# Altium project PCB_Project.PrjPcb
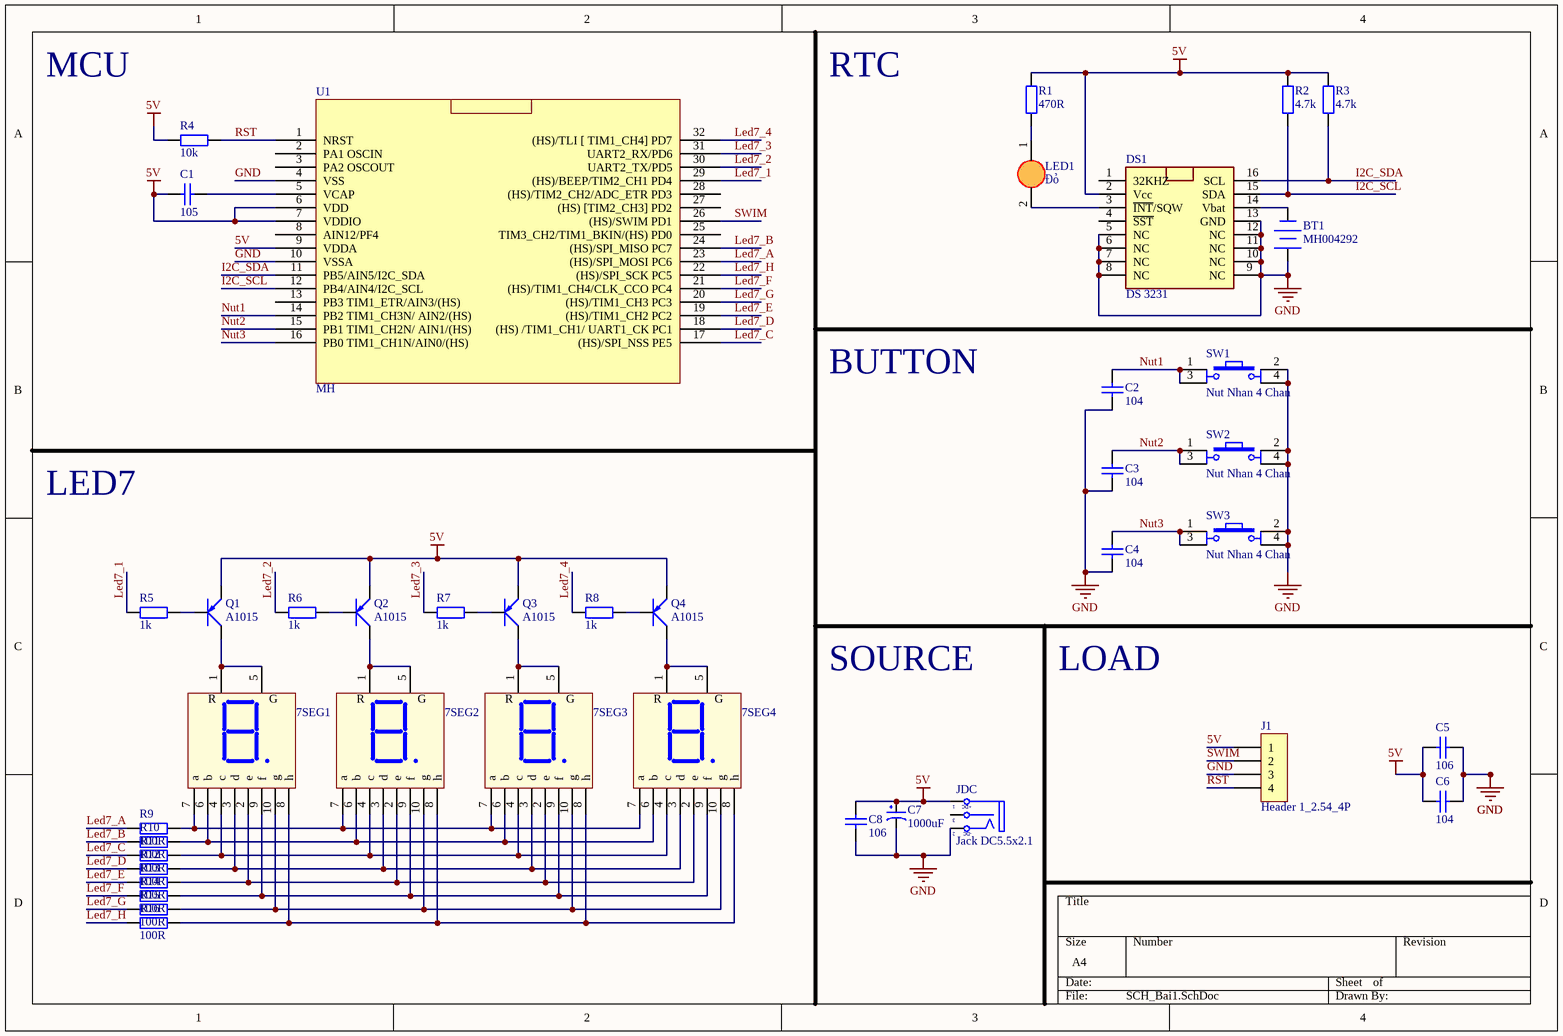
[diagram p0: SCH_Bai1.SchDoc]
1 sheet, 41 parts. Net scope: global (net labels, ports and power ports of the same name join across sheets).
Board file: PCB_Bai1.PcbDoc

## Sheet SCH_Bai1.SchDoc
size A4; SheetNumber: 1; SheetTotal: 1

### Parts
7SEG1  Led 7 Thanh 2.3 Inch Anot  [LED 7 THANH X 1.8INCH]  (value not drawn)
7SEG2  Led 7 Thanh 2.3 Inch Anot  [LED 7 THANH X 1.8INCH]  (value not drawn)
7SEG3  Led 7 Thanh 2.3 Inch Anot  [LED 7 THANH X 1.8INCH]  (value not drawn)
7SEG4  Led 7 Thanh 2.3 Inch Anot  [LED 7 THANH X 1.8INCH]  (value not drawn)
BT1  MH004292  [DE PINCR1220]
C1  105  [tu 0805]
C2  104  [tu 0805]
C3  104  [tu 0805]
C4  104  [tu 0805]
C5  106  [Tu 0805]
C6  104  [tu 0805]
C7  1000uF  [tu hoa 13mm]
C8  106  [Tu 0805]
DS1  DS 3231  [SOP16]
J1  Header 1_2.54_4P  [Header_Duc Cong_4P 2.54]
JDC  Jack DC5.5x2.1  [DC-IN]
LED1  Đỏ  [led 0805]
Q1  A1015  [SOT23]
Q2  A1015  [SOT23]
Q3  A1015  [SOT23]
Q4  A1015  [SOT23]
R1  470R  [Tro SMD 0805]
R2  4.7k  [tro smd 0805]
R3  4.7k  [tro smd 0805]
R4  10k  [tro smd 0805]
R5  1k  [tro smd 0805]
R6  1k  [tro smd 0805]
R7  1k  [tro smd 0805]
R8  1k  [tro smd 0805]
R9  100R  [tro smd 0805]
R10  100R  [tro smd 0805]
R11  100R  [tro smd 0805]
R12  100R  [tro smd 0805]
R13  100R  [tro smd 0805]
R14  100R  [tro smd 0805]
R15  100R  [tro smd 0805]
R16  100R  [tro smd 0805]
SW1  Nut Nhan 4 Chan  [SW4]
SW2  Nut Nhan 4 Chan  [SW4]
SW3  Nut Nhan 4 Chan  [SW4]
U1  MH  [32A_M]

### Nets
5V: C1.2 C5.2 C6.2 C7.1 C8.1 DS1.2(Vcc) J1.1 JDC.1(T) Q1.3(E) Q2.3(E) Q3.3(E) Q4.3(E) R1.1 R2.2 R3.2 R4.1 U1.6(VDD) U1.7(VDDIO) U1.9(VDDA)
GND: BT1.1(+) C2.2 C3.2 C4.2 C5.1 C6.1 C7.2 C8.2 DS1.5(NC) DS1.6(NC) DS1.7(NC) DS1.8(NC) DS1.9(NC) DS1.10(NC) DS1.11(NC) DS1.12(NC) DS1.13(GND) J1.3 JDC.2(TN) SW1.2 SW1.4 SW2.2 SW2.4 SW3.2 SW3.4 U1.4(VSS) U1.10(VSSA)
I2C_SCL: DS1.15(SDA) R2.1 U1.12(PB4/AIN4/I2C_SCL)
I2C_SDA: DS1.16(SCL) R3.1 U1.11(PB5/AIN5/I2C_SDA)
Led7_1: R5.1 U1.29((HS)/BEEP/TIM2_CH1_PD4)
Led7_2: R6.1 U1.30(UART2_TX/PD5)
Led7_3: R7.1 U1.31(UART2_RX/PD6)
Led7_4: R8.1 U1.32((HS)/TLI_[_TIM1_CH4]_PD7)
Led7_A: R9.1 U1.23((HS)/SPI_MOSI_PC6)
Led7_B: R10.1 U1.24((HS)/SPI_MISO_PC7)
Led7_C: R11.1 U1.17((HS)/SPI_NSS_PE5)
Led7_D: R12.1 U1.18((HS)_/TIM1_CH1/_UART1_CK_PC1)
Led7_E: R13.1 U1.19((HS)/TIM1_CH2_PC2)
Led7_F: R14.1 U1.21((HS)/TIM1_CH4/CLK_CCO_PC4)
Led7_G: R15.1 U1.20((HS)/TIM1_CH3_PC3)
Led7_H: R16.1 U1.22((HS)/SPI_SCK_PC5)
Nut1: C2.1 SW1.1 SW1.3 U1.14(PB2_TIM1_CH3N/_AIN2/(HS))
Nut2: C3.1 SW2.1 SW2.3 U1.15(PB1_TIM1_CH2N/_AIN1/(HS))
Nut3: C4.1 SW3.1 SW3.3 U1.16(PB0_TIM1_CH1N/AIN0/(HS))
RST: J1.4 R4.2 U1.1(NRST)
SWIM: J1.2 U1.26((HS)/SWIM_PD1)
Net7SEG1_1: 7SEG1.1(R) 7SEG1.5(COM) Q1.2(C)
Net7SEG1_2: 7SEG1.2(e) 7SEG2.2(e) 7SEG3.2(e) 7SEG4.2(e) R13.2
Net7SEG1_3: 7SEG1.3(d) 7SEG2.3(d) 7SEG3.3(d) 7SEG4.3(d) R12.2
Net7SEG1_4: 7SEG1.4(c) 7SEG2.4(c) 7SEG3.4(c) 7SEG4.4(c) R11.2
Net7SEG1_6: 7SEG1.6(b) 7SEG2.6(b) 7SEG3.6(b) 7SEG4.6(b) R10.2
Net7SEG1_7: 7SEG1.7(a) 7SEG2.7(a) 7SEG3.7(a) 7SEG4.7(a) R9.2
Net7SEG1_8: 7SEG1.8(h) 7SEG2.8(h) 7SEG3.8(h) 7SEG4.8(h) R16.2
Net7SEG1_9: 7SEG1.9(f) 7SEG2.9(f) 7SEG3.9(f) 7SEG4.9(f) R14.2
Net7SEG1_10: 7SEG1.10(g) 7SEG2.10(g) 7SEG3.10(g) 7SEG4.10(g) R15.2
Net7SEG2_1: 7SEG2.1(R) 7SEG2.5(COM) Q2.2(C)
Net7SEG3_1: 7SEG3.1(R) 7SEG3.5(COM) Q3.2(C)
Net7SEG4_1: 7SEG4.1(R) 7SEG4.5(COM) Q4.2(C)
NetBT1_2: BT1.2(-) DS1.14(Vbat)
NetC1_1: C1.1 U1.5(VCAP)
NetDS1_3: DS1.3(~{INT}/SQW) LED1.2(K)
NetLED1_1: LED1.1(A) R1.2
NetQ1_1: Q1.1(B) R5.2
NetQ2_1: Q2.1(B) R6.2
NetQ3_1: Q3.1(B) R7.2
NetQ4_1: Q4.1(B) R8.2

Not connected (* = marked no-connect by the designer): DS1 1(32KHZ) 4(~{SST}); JDC 3(S); U1 2(PA1_OSCIN) 3(PA2_OSCOUT) 8(AIN12/PF4) 13(PB3_TIM1_ETR/AIN3/(HS)) 25(TIM3_CH2/TIM1_BKIN/(HS)_PD0) 27((HS)_[TIM2_CH3]_PD2) 28((HS)/TIM2_CH2/ADC_ETR_PD3)

### Notes on the sheet
- MCU
- RTC
- BUTTON
- LED7
- SOURCE
- LOAD
- (in symbol Jac_DC) +DC; -DC
- (in symbol LED 7SEG 2.3Inch) G

### Library data of the parts
7SEG1-7SEG4 = LED 7SEG 2.3Inch: Single 7 Seg Dipslay 29x41 mm; Value: LED 7S SEG
BT1 = De Pin 3.3V: Dán; LatestRevisionDate: Đế Pin CR2032 SMD003
C1 = Tu 0805 105 50V 10%: Dán; Don_Vi: Con; So_Chan: 2; Ten_Linh_Kien: Tụ 0805 105-1uF 10% 50V; Ma_Hang: MH004552; Chung_Loai: Dán; Kieu_Chan: *
C2-C4 C6 = Tu 0805 104 50V 10%: Dán; Don_Vi: Con; So_Chan: 2; Ten_Linh_Kien: Tụ 0805 104-100nF 10% 50V; Ma_Hang: MH004551; Chung_Loai: Dán; Kieu_Chan: *
C5 C8 = Tu 0805 106 16V 10%: Dán; Ten_Linh_Kien: Tụ 0805 106-10uF 10% 16V; So_Chan: 2; Don_Vi: Con; Ma_Hang: MH004553; Chung_Loai: Dán; Kieu_Chan: *
C7 = Tu Hoa 1000uF 25V 13x21: Cắm; Don_Vi: Con; So_Chan: 2; Ten_Linh_Kien: Tụ Hóa 1000uF 25V 13x21MM; Ma_Hang: MH002315; Chung_Loai: Cắm; Kieu_Chan: *
DS1 = DS 3231: Dán; Ma_Hang: MH002604; Don_Vi: Con; Ten_Linh_Kien: DS3231N SOIC16; Ghi_Chu: *; Chung_Loai: Dán; Kieu_Chan: *
J1 = Header 1_2.54_4P: Cắm; Chung_Loai: Cắm
JDC = Jac_DC: Cắm; Ten_Linh_Kien: Jack DC5.5x2.1MM DC5501; Ma_Hang: MH000923; Don_Vi: Con; Kieu_Chan: *; Ghi_Chu: *; Chung_Loai: Cắm
LED1 = LED 0805: Dán; Don_Vi: Con; Chung_Loai: Cắm; Ten_Linh_kien: *; Ghi_Chu: *; Kieu_Chan: *; Ma_Hang: *
Q1-Q4 = A1015: Dán; Ten_Linh_Kien: A1015 SOT23 TRANS PNP 0.15A 50V ( SMD-BA); Don_Vi: Con; Ma_Hang: MH001957; Ghi_Chu: *; Kieu_Chan: *; Chung_Loai: Dán
R1 = Tro 0805 5% 470R: Dán; Don_Vi: Con; Ma_Hang: MH005341; Ten_Linh_Kien: Trở 0805 5% 470R; So_Chan: 2; Chung_Loai: Dán; Kieu_Chan: *
R2 R3 = Tro 0805 5% 4.7k: Dán; Don_Vi: Con; So_Chan: 2; Ten_Linh_Kien: Trở 0805 5% 4.7k; Ma_Hang: MH005307; Chung_Loai: Dán; Kieu_Chan: *
R4 = Tro 0805 1% 10k: Dán; Don_Vi: Con; So_Chan: 2; Ten_Linh_Kien: Trở 0805 1% 10k; Ma_Hang: MH005473; Chung_Loai: Dán; Kieu_Chan: *
R5 = Tro 0805 5% 1k: Dán; Don_Vi: Con; So_Chan: 2; Ten_Linh_Kien: Trở 0805 5% 1k; Ma_Hang: MH005234; Chung_Loai: Dán; Kieu_Chan: *
R6-R8 = Tro 0805 1% 1k: Dán; Don_Vi: Con; So_Chan: 2; Ten_Linh_Kien: Trở 0805 1% 1k; Ma_Hang: MH005468; Chung_Loai: Dán; Kieu_Chan: *
R9-R16 = Tro 0805 5% 100R: Dán; Don_Vi: Con; So_Chan: 2; Ten_Linh_Kien: Trở 0805 5% 100R; Ma_Hang: MH005251; Chung_Loai: Dán; Kieu_Chan: *
SW1-SW3 = Nut Nhan 4 Chan: Cắm; Value: Nút Nhấn 4 Chân 6x6x9MM DIP; Ma_Hang: MH004077; Don_Vi: Con; Kieu Chan: *; Ghi Chu: *
U1 = STM8S005K6T6C: Dán; Value: STM8S005K6T6C